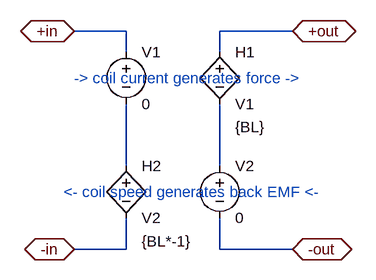
[diagram p0: schematic BL.asc]
BL.asc, the LTspice schematic file:
Version 4
SHEET 1 880 680
WIRE -80 -48 -160 -48
WIRE 176 -48 64 -48
WIRE -80 -16 -80 -48
WIRE 64 -16 64 -48
WIRE -80 160 -80 64
WIRE 64 160 64 64
WIRE -80 288 -80 240
WIRE -80 288 -160 288
WIRE 64 288 64 240
WIRE 176 288 64 288
FLAG -160 -48 +in
IOPIN -160 -48 BiDir
FLAG -160 288 -in
IOPIN -160 288 BiDir
FLAG 176 -48 +out
IOPIN 176 -48 BiDir
FLAG 176 288 -out
IOPIN 176 288 BiDir
SYMBOL h 64 -32 R0
WINDOW 123 24 132 Left 0
SYMATTR Value2 {BL}
SYMATTR InstName H1
SYMATTR Value V1
SYMBOL voltage -80 -32 R0
WINDOW 123 0 0 Left 0
WINDOW 39 0 0 Left 0
SYMATTR InstName V1
SYMATTR Value 0
SYMBOL h -80 144 R0
WINDOW 123 24 132 Left 0
SYMATTR Value2 {BL*-1}
SYMATTR InstName H2
SYMATTR Value V2
SYMBOL voltage 64 144 R0
WINDOW 123 0 0 Left 0
WINDOW 39 0 0 Left 0
SYMATTR InstName V2
SYMATTR Value 0
TEXT -160 24 Left 0 ;-> coil current generates force ->
TEXT -176 200 Left 0 ;<- coil speed generates back EMF <-

The netlist it stands for:
* BL.asc
H1 +out N002 V1 {BL}
V1 +in N001 0
H2 N001 -in V2 {BL*-1}
V2 N002 -out 0
* -> coil current generates force ->
* <- coil speed generates back EMF <-
.backanno
.end